# Altium schematic sheet 0049_GLITCH FREE CIRCUI.SchDoc
size A3
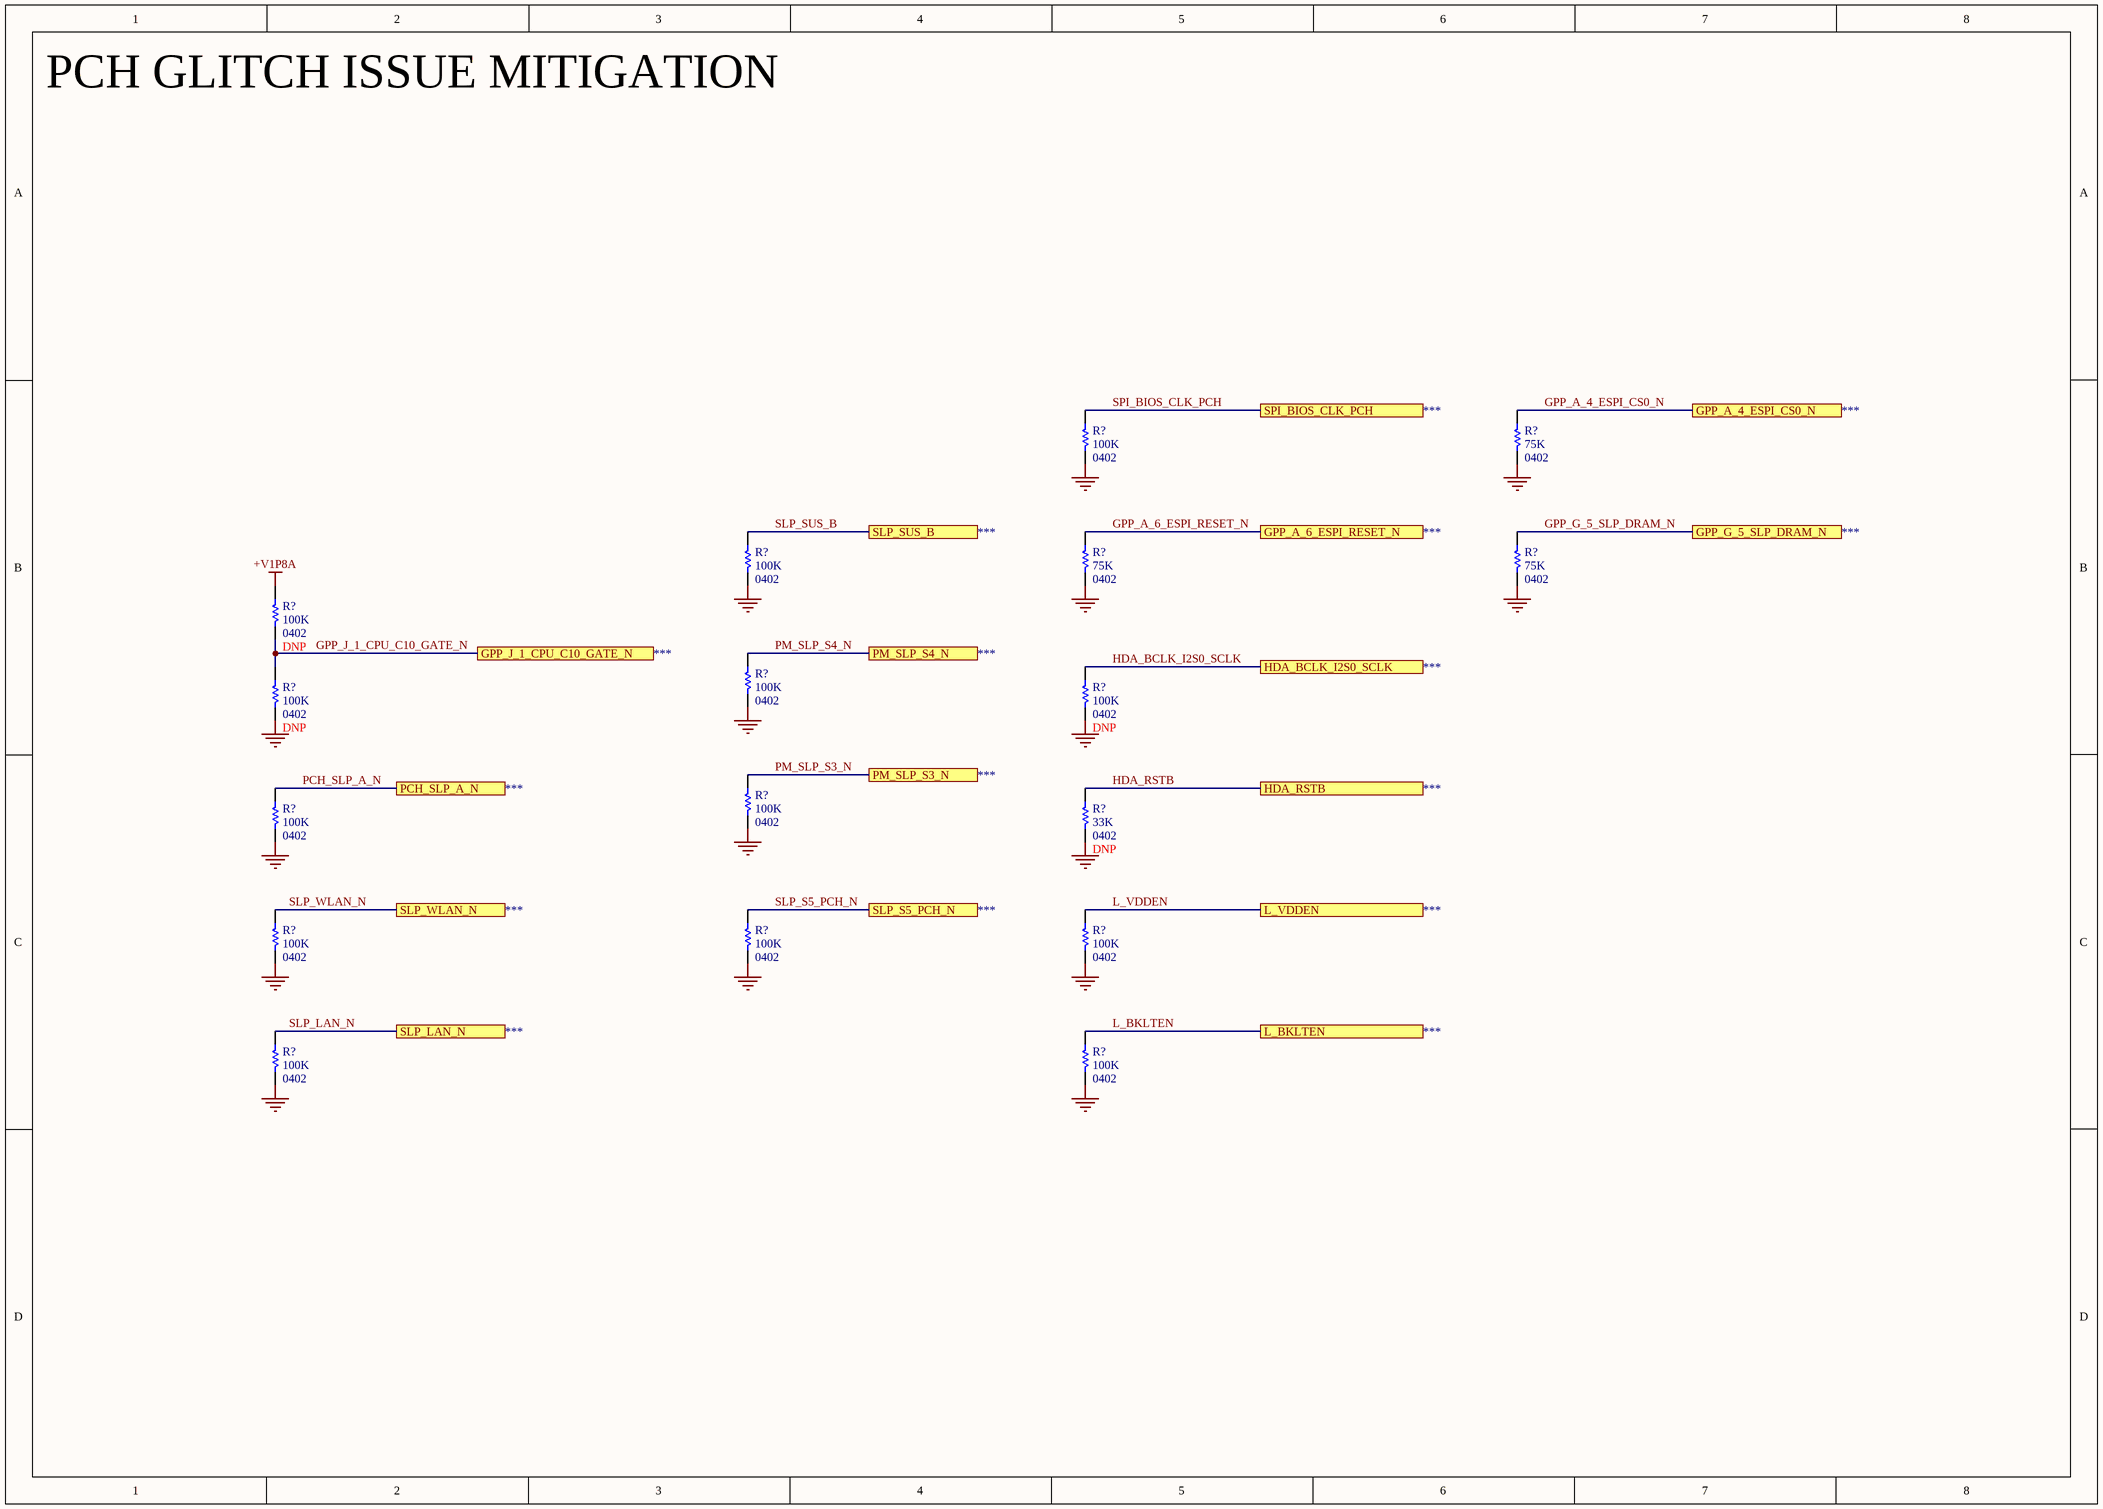
[diagram p0: 0049_GLITCH FREE CIRCUI.SchDoc]

## Parts
(Parts that share a designator on the sheet are numbered #1, #2 ... from top to bottom, then left to right.)
R?#1  value 100K  Case/Package: 0402  [RESC0402]  (hidden comment: Res)
R?#2  value 75K  Case/Package: 0402  [RESC0402]  (hidden comment: Res)
R?#3  value 100K  Case/Package: 0402  [RESC0402]  (hidden comment: Res)
R?#4  value 75K  Case/Package: 0402  [RESC0402]  (hidden comment: Res)
R?#5  value 75K  Case/Package: 0402  [RESC0402]  (hidden comment: Res)
R?#6  value 100K  Case/Package: 0402  [RESC0402]  (hidden comment: Res)
R?#7  value 100K  Case/Package: 0402  [RESC0402]  (hidden comment: Res)
R?#8  value 100K  Case/Package: 0402  [RESC0402]  (hidden comment: Res)
R?#9  value 100K  Case/Package: 0402  [RESC0402]  (hidden comment: Res)
R?#10  value 100K  Case/Package: 0402  [RESC0402]  (hidden comment: Res)
R?#11  value 100K  Case/Package: 0402  [RESC0402]  (hidden comment: Res)
R?#12  value 33K  Case/Package: 0402  [RESC0402]  (hidden comment: Res)
R?#13  value 100K  Case/Package: 0402  [RESC0402]  (hidden comment: Res)
R?#14  value 100K  Case/Package: 0402  [RESC0402]  (hidden comment: Res)
R?#15  value 100K  Case/Package: 0402  [RESC0402]  (hidden comment: Res)
R?#16  value 100K  Case/Package: 0402  [RESC0402]  (hidden comment: Res)
R?#17  value 100K  Case/Package: 0402  [RESC0402]  (hidden comment: Res)

## Ports
GPP_A_4_ESPI_CS0_N, GPP_A_6_ESPI_RESET_N, GPP_G_5_SLP_DRAM_N, GPP_J_1_CPU_C10_GATE_N, HDA_BCLK_I2S0_SCLK, HDA_RSTB, L_BKLTEN, L_VDDEN, PCH_SLP_A_N, PM_SLP_S3_N, PM_SLP_S4_N, SLP_LAN_N, SLP_S5_PCH_N, SLP_SUS_B, SLP_WLAN_N, SPI_BIOS_CLK_PCH

## Nets
+V1P8A: R?#6.2
GND: R?#1.1 R?#2.1 R?#3.1 R?#4.1 R?#5.1 R?#7.1 R?#8.1 R?#9.1 R?#10.1 R?#11.1 R?#12.1 R?#13.1 R?#14.1 R?#15.1 R?#16.1 R?#17.1
GPP_A_4_ESPI_CS0_N: R?#2.2 ; port GPP_A_4_ESPI_CS0_N
GPP_A_6_ESPI_RESET_N: R?#4.2 ; port GPP_A_6_ESPI_RESET_N
GPP_G_5_SLP_DRAM_N: R?#5.2 ; port GPP_G_5_SLP_DRAM_N
GPP_J_1_CPU_C10_GATE_N: R?#6.1 R?#8.2 ; port GPP_J_1_CPU_C10_GATE_N
HDA_BCLK_I2S0_SCLK: R?#9.2 ; port HDA_BCLK_I2S0_SCLK
HDA_RSTB: R?#12.2 ; port HDA_RSTB
L_BKLTEN: R?#17.2 ; port L_BKLTEN
L_VDDEN: R?#15.2 ; port L_VDDEN
PCH_SLP_A_N: R?#11.2 ; port PCH_SLP_A_N
PM_SLP_S3_N: R?#10.2 ; port PM_SLP_S3_N
PM_SLP_S4_N: R?#7.2 ; port PM_SLP_S4_N
SLP_LAN_N: R?#16.2 ; port SLP_LAN_N
SLP_S5_PCH_N: R?#14.2 ; port SLP_S5_PCH_N
SLP_SUS_B: R?#3.2 ; port SLP_SUS_B
SLP_WLAN_N: R?#13.2 ; port SLP_WLAN_N
SPI_BIOS_CLK_PCH: R?#1.2 ; port SPI_BIOS_CLK_PCH

## Notes on the sheet
- PCH GLITCH ISSUE MITIGATION

## Library data of the parts
R?#1 R?#3 R?#6-R?#11 R?#13-R?#17 = Res: Thick Film Resistor -  100Kohm, 1%, 0402
  R?#6 R?#8 R?#9: DNP: DNP
R?#2 R?#4 R?#5 = Res: Thick Film Resistor -  75Kohm, 1%, 0402
R?#12 = Res: Thick Film Resistor -  33Kohm, 1%, 0402; DNP: DNP